# Altium project BLDC.PRJPCB
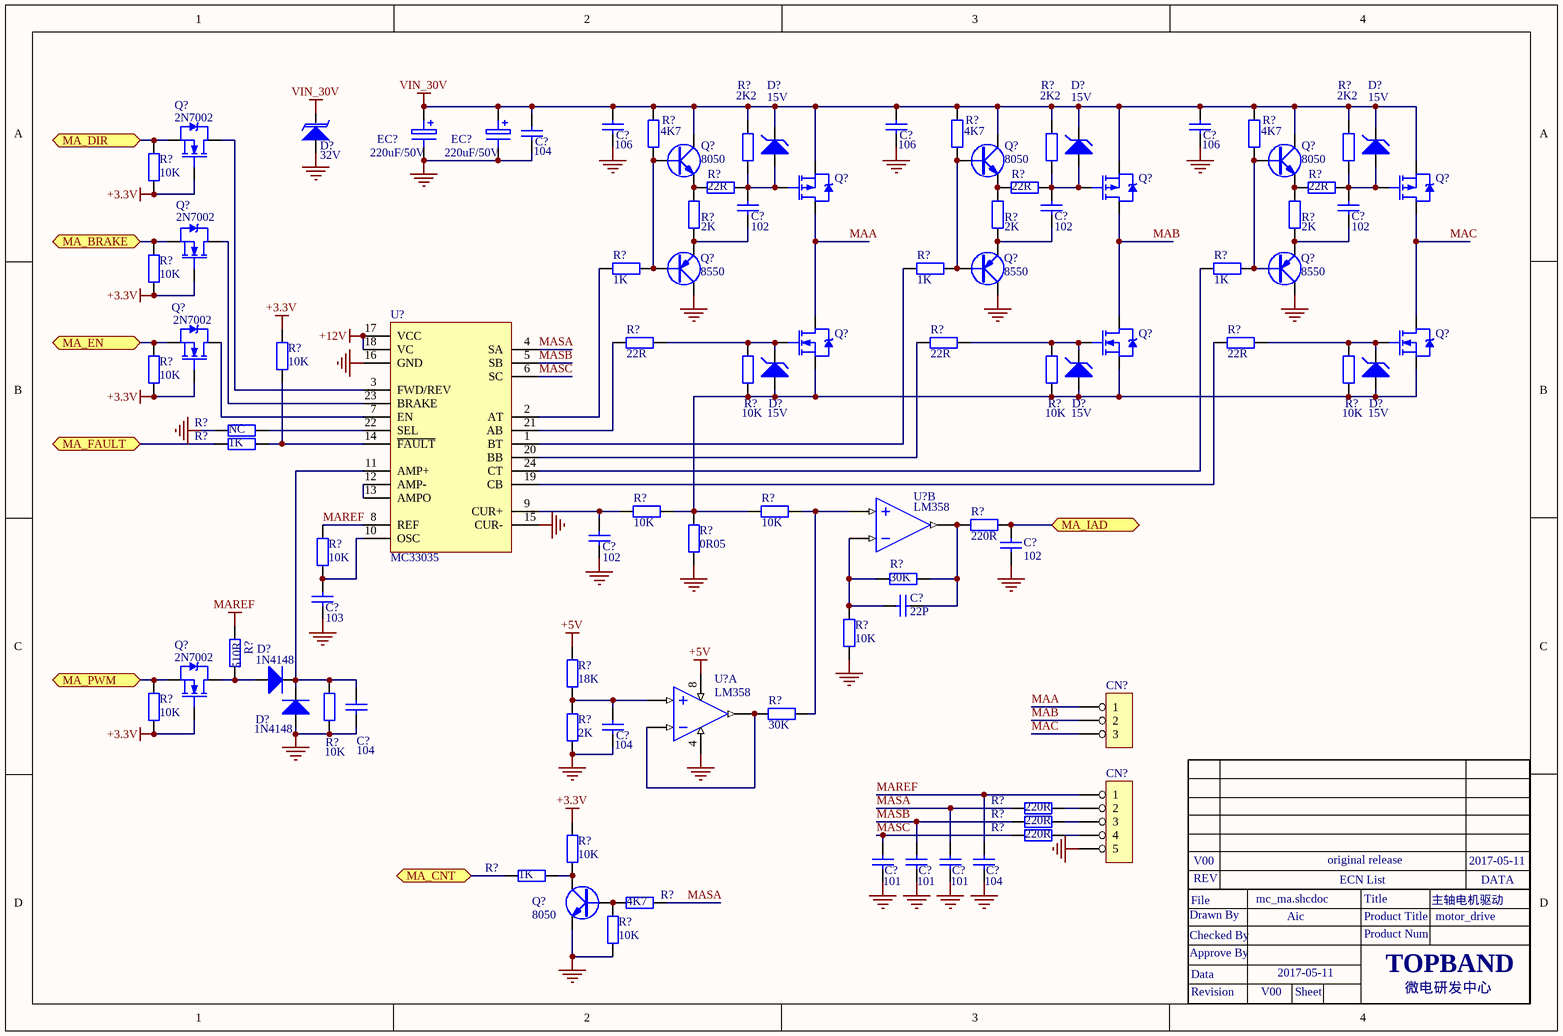
[diagram p0: mc_bldc.SchDoc]
2 sheets, 132 parts. Net scope: flat (ports and power ports of the same name join across sheets).
Sheets:
  mc_bldc.SchDoc
  mc_ds.SchDoc

## Sheet mc_bldc.SchDoc
size A4

### Parts
(Parts that share a designator on the sheet are numbered #1, #2 ... from top to bottom, then left to right.)
C?#1  106  [0603C]
C?#2  106  [0603C]
C?#3  106  [0603C]
C?#4  104  [0603C]
C?#5  102  [0805C]
C?#6  102  [0805C]
C?#7  102  [0805C]
C?#8  102  [0805C]
C?#9  102  [0603C]
C?#10  103  [0805C]
C?#11  22P  [0603C]
C?#12  104  [0805C]
C?#13  104  [0603C]
C?#14  101  [0603C]
C?#15  101  [0603C]
C?#16  101  [0603C]
C?#17  104  [0603C]
CN?#1  (no value)  [con3-2.54pa]
CN?#2  (no value)  [CON5-2.54卧式]
D?#1  32V  [SOD-123]
D?#2  15V  [SOD-123]
D?#3  15V  [SOD-123]
D?#4  15V  [SOD-123]
D?#5  15V  [SOD-123]
D?#6  15V  [SOD-123]
D?#7  15V  [SOD-123]
D?#8  1N4148  [SOD-123]
D?#9  1N4148  [SOD-123]
EC?#1  220uF/50V  [EC8]
EC?#2  220uF/50V  [EC8]
Q?#1  8050  [SOT-23-BCE]
Q?#2  8050  [SOT-23-BCE]
Q?#3  8050  [SOT-23-BCE]
Q?#4  2N7002  [D2PAK]
Q?#5  (no value)  [D2PAK]
Q?#6  (no value)  [D2PAK]
Q?#7  (no value)  [D2PAK]
Q?#8  8550  [SOT-23-BCE]
Q?#9  8550  [SOT-23-BCE]
Q?#10  8550  [SOT-23-BCE]
Q?#11  2N7002  [D2PAK]
Q?#12  (no value)  [D2PAK]
Q?#13  (no value)  [D2PAK]
Q?#14  (no value)  [D2PAK]
Q?#15  2N7002  [D2PAK]
Q?#16  2N7002  [D2PAK]
Q?#17  8050  [SOT-23-BCE]
R?#1  4K7  [0603R]
R?#2  4K7  [0603R]
R?#3  4K7  [0603R]
R?#4  2K2  [0805R]
R?#5  2K2  [0805R]
R?#6  2K2  [0805R]
R?#7  22R  [0805R]
R?#8  22R  [0805R]
R?#9  22R  [0805R]
R?#10  10K  [0603R]
R?#11  2K  [0805R]
R?#12  2K  [0805R]
R?#13  2K  [0805R]
R?#14  1K  [0603R]
R?#15  1K  [0603R]
R?#16  1K  [0603R]
R?#17  10K  [0603R]
R?#18  22R  [0805R]
R?#19  22R  [0805R]
R?#20  22R  [0805R]
R?#21  10K  [0603R]
R?#22  10K  [0603R]
R?#23  10K  [0603]
R?#24  10K  [0603]
R?#25  10K  [0603]
R?#26  NC  [0603R]
R?#27  1K  [0603R]
R?#28  10K  [0603R]
R?#29  10K  [0603R]
R?#30  220R  [0603R]
R?#31  0R05  [2512R]
R?#32  10K  [0603R]
R?#33  30K  [0603R]
R?#34  10K  [0603R]
R?#35  510R  [0603R]
R?#36  18K  [0603R]
R?#37  30K  [0603R]
R?#38  10K  [0603R]
R?#39  10K  [0603R]
R?#40  2K  [0603R]
R?#41  220R  [0603R]
R?#42  220R  [0603R]
R?#43  220R  [0603R]
R?#44  1K  [0603R]
R?#45  10K  [0603R]
R?#46  4K7  [0603R]
R?#47  10K  [0603R]
U?#1  MC33035  [SOP-24]
U?#2  LM358  [SO-8]  (part B of 2)
U?#3  LM358  [SO-8]  (part A of 2)

### Ports
MA_BRAKE, MA_CNT, MA_DIR, MA_EN, MA_FAULT, MA_IAD, MA_PWM

### Nets
+3.3V: Q?#4.G Q?#11.G Q?#15.G Q?#16.G R?#10.1 R?#17.1 R?#21.2 R?#22.1 R?#38.1 R?#45.2
+5V: R?#36.2 U?#3.8(VCC)
+12V: U?#1.17(VCC) U?#1.18(VC)
GND: C?#1.1 C?#2.1 C?#3.1 C?#4.1 C?#8.2 C?#9.2 C?#10.2 C?#12.2 C?#13.1 C?#14.2 C?#15.2 C?#16.2 C?#17.2 CN?#2.5 D?#1.A D?#9.A EC?#1.2 EC?#2.2 Q?#8.C Q?#9.C Q?#10.C Q?#17.E R?#26.1 R?#31.1 R?#34.1 R?#39.1 R?#40.1 R?#47.1 U?#1.15(CUR-) U?#1.16(GND) U?#3.4(GND)
MAREF: C?#17.1 CN?#2.1 R?#32.2 R?#35.2 U?#1.8(REF)
VIN_30V: C?#1.2 C?#2.2 C?#3.2 C?#4.2 D?#1.K D?#2.K D?#3.K D?#4.K EC?#1.1 EC?#2.1 Q?#1.C Q?#2.C Q?#3.C Q?#5.S Q?#6.S Q?#7.S R?#1.1 R?#2.1 R?#3.1 R?#4.1 R?#5.1 R?#6.1
MAA: CN?#1.1 Q?#5.D Q?#12.D
MAB: CN?#1.2 Q?#6.D Q?#13.D
MAC: CN?#1.3 Q?#7.D Q?#14.D
MASA: C?#16.1 R?#41.1 R?#46.2 U?#1.4(SA)
MASB: C?#15.1 R?#42.1 U?#1.5(SB)
MASC: C?#14.1 R?#43.1 U?#1.6(SC)
NetC?#5_1: C?#5.1 D?#2.A Q?#5.G R?#4.2 R?#7.2
NetC?#5_2: C?#5.2 Q?#8.E R?#11.2
NetC?#6_1: C?#6.1 D?#3.A Q?#6.G R?#5.2 R?#8.2
NetC?#6_2: C?#6.2 Q?#9.E R?#12.2
NetC?#7_1: C?#7.1 D?#4.A Q?#7.G R?#6.2 R?#9.2
NetC?#7_2: C?#7.2 Q?#10.E R?#13.2
NetC?#8_1: C?#8.1 R?#28.1 U?#1.9(CUR+)
NetC?#9_1: C?#9.1 R?#30.2 ; port MA_IAD
NetC?#10_1: C?#10.1 R?#32.1 U?#1.10(OSC)
NetC?#11_1: C?#11.1 R?#30.1 R?#33.1 U?#2.1(OUT2)
NetC?#11_2: C?#11.2 R?#33.2 R?#34.2 U?#2.2(-IN2)
NetC?#12_1: C?#12.1 D?#8.K D?#9.K R?#39.2 U?#1.11(AMP+)
NetC?#13_2: C?#13.2 R?#36.1 R?#40.2 U?#3.5(+IN1)
NetCN?#2_2: CN?#2.2 R?#41.2
NetCN?#2_3: CN?#2.3 R?#42.2
NetCN?#2_4: CN?#2.4 R?#43.2
NetD?#5_A: D?#5.A D?#6.A D?#7.A Q?#12.S Q?#13.S Q?#14.S R?#23.1 R?#24.1 R?#25.1 R?#28.2 R?#29.1 R?#31.2
NetD?#5_K: D?#5.K Q?#12.G R?#18.2 R?#23.2
NetD?#6_K: D?#6.K Q?#13.G R?#19.2 R?#24.2
NetD?#7_K: D?#7.K Q?#14.G R?#20.2 R?#25.2
NetD?#8_A: D?#8.A Q?#16.D R?#35.1
NetQ?#1_B: Q?#1.B Q?#8.B R?#1.2 R?#14.2
NetQ?#1_E: Q?#1.E R?#7.1 R?#11.1
NetQ?#2_B: Q?#2.B Q?#9.B R?#2.2 R?#15.2
NetQ?#2_E: Q?#2.E R?#8.1 R?#12.1
NetQ?#3_B: Q?#3.B Q?#10.B R?#3.2 R?#16.2
NetQ?#3_E: Q?#3.E R?#9.1 R?#13.1
NetQ?#4_D: Q?#4.D U?#1.3(FWD/REV)
NetQ?#4_S: Q?#4.S R?#10.2 ; port MA_DIR
NetQ?#11_D: Q?#11.D U?#1.23(BRAKE)
NetQ?#11_S: Q?#11.S R?#17.2 ; port MA_BRAKE
NetQ?#15_D: Q?#15.D U?#1.7(EN)
NetQ?#15_S: Q?#15.S R?#22.2 ; port MA_EN
NetQ?#16_S: Q?#16.S R?#38.2 ; port MA_PWM
NetQ?#17_B: Q?#17.B R?#46.1 R?#47.2
NetQ?#17_C: Q?#17.C R?#44.2 R?#45.1
NetR?#14_1: R?#14.1 U?#1.2(AT)
NetR?#15_1: R?#15.1 U?#1.1(BT)
NetR?#16_1: R?#16.1 U?#1.24(CT)
NetR?#18_1: R?#18.1 U?#1.21(AB)
NetR?#19_1: R?#19.1 U?#1.20(BB)
NetR?#20_1: R?#20.1 U?#1.19(CB)
NetR?#21_1: R?#21.1 R?#27.2 U?#1.14(~{FAULT})
NetR?#26_2: R?#26.2 U?#1.22(SEL)
NetR?#27_1: R?#27.1 ; port MA_FAULT
NetR?#29_2: R?#29.2 R?#37.2 U?#2.3(IN2+)
NetR?#37_1: R?#37.1 U?#3.6(-IN1) U?#3.7(OUT1)
NetR?#44_1: R?#44.1 ; port MA_CNT
NetU?#1_12: U?#1.12(AMP-) U?#1.13(AMPO)

### Notes on the sheet
- Drawn By
- File
- REV
- V00
- mc_ma.shcdoc
- Aic
- original release
- ECN List
- Product Title
- Title
- 主轴电机驱动
- motor_drive
- 2017-05-11
- DATA
- Approve By
- Checked By
- Data
- Product Num
- TOPBAND
- Revision
- Sheet
- 微电研发中心

### Library data of the parts
C?#1-C?#17 = Cap(0603): Component Kind: standard; Component Type: standard
CN?#1 = 3P: 排线; U_TABLE: U_SAM01021604; id: 21; Part Number: 3P; Component Kind: standard; Component Type: standard; Designator: 3P; Pin Count: 3
CN?#2 = 5Pin(卧式): 插座; U_TABLE: U_SAM01021601; id: 32; Part Number: 5Pin(卧式); Component Kind: standard; Component Type: standard; Designator: 5Pin(卧式); Pin Count: 5
D?#1 = Diode(TVS_贴片)_1: TVS管; U_TABLE: U_SAM010203; id: 28; Part Number: Diode(TVS_贴片)_1; Component Kind: standard; Component Type: standard; Pin Count: 2
D?#2-D?#7 = D Zener(贴片): 120301465; U_TABLE: U_SAM010203; id: 25; Description: 稳压二极管; Part Number: D Zener(贴片); Component Kind: standard; Component Type: standard; Pin Count: 2
D?#8 D?#9 = Diode(贴片)_1: 二极管; U_TABLE: U_SAM010203; id: 27; Part Number: Diode(贴片)_1; Component Kind: standard; Component Type: standard; Pin Count: 2
EC?#1 EC?#2 = Electro(2.5mm): 电解电容; U_TABLE: U_SAM010202; id: 42; Part Number: Electro(2.5mm); Component Kind: standard; Component Type: standard; Pin Count: 2
Q?#1-Q?#3 Q?#17 = NPN(贴片): 三极管; U_TABLE: U_SAM010204; id: 18; Part Number: NPN(贴片); Component Kind: standard; Component Type: standard; Pin Count: 3
Q?#4 Q?#11-Q?#16 = NMOS-2: MOS管; U_TABLE: U_SAM010204; id: 17; Part Number: NMOS-2; Component Kind: standard; Component Type: standard; Pin Count: 3
Q?#5-Q?#7 = PMOS-2: MOS管; U_TABLE: U_SAM010204; id: 19; Part Number: PMOS-2; Component Kind: standard; Component Type: standard; Pin Count: 3
Q?#8-Q?#10 = PNP(贴片): 三极管; U_TABLE: U_SAM010204; id: 20; Part Number: PNP(贴片); Component Kind: standard; Component Type: standard; Pin Count: 3
R?#1-R?#13 R?#17-R?#26 R?#28 R?#31 R?#32 R?#35 R?#38 R?#39 R?#41-R?#43 R?#45-R?#47 = Res2: Resistor; Value: 1K; 物料编码: 150103083; Published: 8-Jun-2000; LatestRevisionDate: 17-Jul-2002; LatestRevisionNote: Re-released for DXP Platform.; PackageReference: AXIAL-0.4; Publisher: Altium Limited
R?#14-R?#16 R?#27 R?#44 = Res2: Resistor; 物料编码: 150103083; Published: 8-Jun-2000; LatestRevisionDate: 17-Jul-2002; LatestRevisionNote: Re-released for DXP Platform.; PackageReference: AXIAL-0.4; Publisher: Altium Limited; Value: 1K
R?#29 R?#30 R?#33 R?#34 R?#37 = Res2: Resistor; Value: 1K; Published: 8-Jun-2000; LatestRevisionDate: 17-Jul-2002; LatestRevisionNote: Re-released for DXP Platform.; PackageReference: AXIAL-0.4; Publisher: Altium Limited
R?#36 R?#40 = Res2: Resistor; Published: 8-Jun-2000; LatestRevisionDate: 17-Jul-2002; LatestRevisionNote: Re-released for DXP Platform.; PackageReference: AXIAL-0.4; Publisher: Altium Limited
U?#2 U?#3 = IC_LM358: 121000225; U_TABLE: U_SAM010210; Description: 集成电路; id: 83; U_ITEM_ID（物料编码）: 121000100; U_100114（SAP物料描述）: SMT运放LM358_SO-8_TI_环保; U_100047（环保属性）: 环保; U_100107（工厂BOM使用频率）: 1000:1;1500:12;3000:7;5000:14;; U_100105（工厂库存）: 1000:7508.000;1500:160.000;2000:0.000;3000:485.000;5000:1542.000;; U_100117（工厂采购量）: 1000:7500.000;1500:300.000;3000:2500.000;5000:7500.000;; Part Number: IC_LM358; Component Kind: standard; Component Type: standard; Designator: IC_LM358; Footprint: DIP14; Pin Count: 8; U_100076（型号）: LM358; U_100040（封装方式）: SO-8; U_100086（指定供应商）: TI

## Sheet mc_ds.SchDoc
size A4
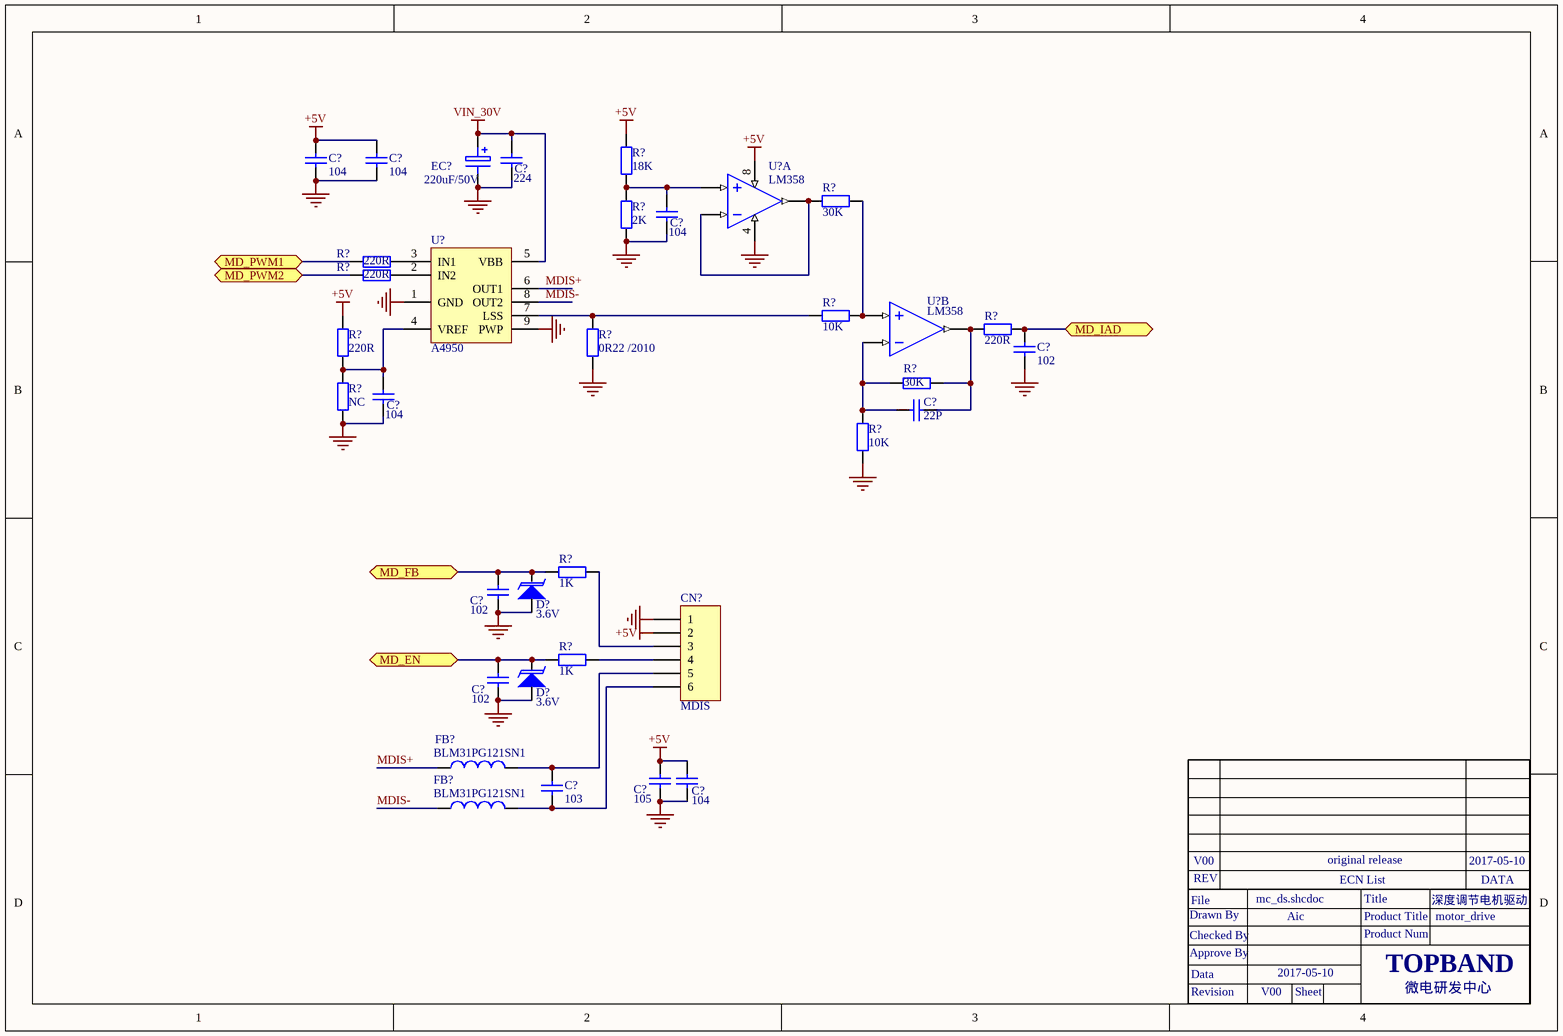
[diagram p1: mc_ds.SchDoc]

### Parts
(Parts that share a designator on the sheet are numbered #1, #2 ... from top to bottom, then left to right.)
C?#18  104  [0603C]
C?#19  104  [0603C]
C?#20  224  [0603C]
C?#21  104  [0603C]
C?#22  102  [0603C]
C?#23  22P  [0603C]
C?#24  104  [0603C]
C?#25  102  [0805C]
C?#26  102  [0805C]
C?#27  105  [0805C]
C?#28  104  [0603C]
C?#29  103  [0805C]
CN?#3  MDIS  [HDR1X6]
D?#10  3.6V  [SOD-123]
D?#11  3.6V  [SOD-123]
EC?#3  220uF/50V  [EC8]
FB?#1  BLM31PG121SN1  [1206R]
FB?#2  BLM31PG121SN1  [1206R]
R?#48  18K  [0603R]
R?#49  30K  [0603R]
R?#50  2K  [0603R]
R?#51  220R  [0603R]
R?#52  220R  [0603R]
R?#53  10K  [0603R]
R?#54  220R  [0603R]
R?#55  220R  [0603R]
R?#56  0R22 /2010  [2010R]
R?#57  30K  [0603R]
R?#58  NC  [0603R]
R?#59  10K  [0603R]
R?#60  1K  [0603R]
R?#61  1K  [0603R]
U?#4  LM358  [SO-8]  (part A of 2)
U?#5  A4950  [SO-8 - E]
U?#6  LM358  [SO-8]  (part B of 2)

### Ports
MD_EN, MD_FB, MD_IAD, MD_PWM1, MD_PWM2

### Nets
+5V: C?#18.2 C?#19.2 C?#27.1 C?#28.1 CN?#3.2 R?#48.2 R?#55.1 U?#4.8(VCC)
GND: C?#18.1 C?#19.1 C?#20.1 C?#21.1 C?#22.2 C?#24.1 C?#25.2 C?#26.2 C?#27.2 C?#28.2 CN?#3.1 D?#10.A D?#11.A EC?#3.2 R?#50.1 R?#56.2 R?#58.1 R?#59.1 U?#4.4(GND) U?#5.1(GND) U?#5.9(PWP)
VIN_30V: C?#20.2 EC?#3.1 U?#5.5(VBB)
MDIS+: FB?#1.1 U?#5.6(OUT1)
MDIS-: FB?#2.1 U?#5.8(OUT2)
NetC?#21_2: C?#21.2 R?#48.1 R?#50.2 U?#4.5(+IN1)
NetC?#22_1: C?#22.1 R?#54.2 ; port MD_IAD
NetC?#23_1: C?#23.1 R?#54.1 R?#57.1 U?#6.1(OUT2)
NetC?#23_2: C?#23.2 R?#57.2 R?#59.2 U?#6.2(-IN2)
NetC?#24_2: C?#24.2 R?#55.2 R?#58.2 U?#5.4(VREF)
NetC?#25_1: C?#25.1 D?#10.K R?#60.2 ; port MD_FB
NetC?#26_1: C?#26.1 D?#11.K R?#61.2 ; port MD_EN
NetC?#29_1: C?#29.1 CN?#3.5 FB?#1.2
NetC?#29_2: C?#29.2 CN?#3.6 FB?#2.2
NetCN?#3_3: CN?#3.3 R?#60.1
NetCN?#3_4: CN?#3.4 R?#61.1
NetR?#49_1: R?#49.1 U?#4.6(-IN1) U?#4.7(OUT1)
NetR?#49_2: R?#49.2 R?#53.2 U?#6.3(IN2+)
NetR?#51_1: R?#51.1 ; port MD_PWM1
NetR?#51_2: R?#51.2 U?#5.3(IN1)
NetR?#52_1: R?#52.1 ; port MD_PWM2
NetR?#52_2: R?#52.2 U?#5.2(IN2)
NetR?#53_1: R?#53.1 R?#56.1 U?#5.7(LSS)

### Notes on the sheet
- Drawn By
- File
- REV
- V00
- mc_ds.shcdoc
- Aic
- original release
- ECN List
- Product Title
- Title
- 深度调节电机驱动
- motor_drive
- 2017-05-10
- DATA
- Approve By
- Checked By
- Data
- Product Num
- TOPBAND
- Revision
- Sheet
- 微电研发中心

### Library data of the parts
C?#18-C?#29 = Cap(0603): Component Kind: standard; Component Type: standard
CN?#3 = Header 6: Header, 6-Pin; LatestRevisionDate: 17-Jul-2002; LatestRevisionNote: Re-released for DXP Platform.; Publisher: Altium Limited
D?#10 D?#11 = Diode(TVS_贴片)_1: TVS管; U_TABLE: U_SAM010203; id: 28; Part Number: Diode(TVS_贴片)_1; Component Kind: standard; Component Type: standard; Pin Count: 2
EC?#3 = Electro(2.5mm): 电解电容; U_TABLE: U_SAM010202; id: 42; Part Number: Electro(2.5mm); Component Kind: standard; Component Type: standard; Pin Count: 2
FB?#1 FB?#2 = Inductor: 电感; U_TABLE: U_SAM010207; id: 53; Part Number: Inductor; Component Kind: Standard; Component Type: Standard; Pin Count: 2
R?#48 R?#50 R?#60 R?#61 = Res2: Resistor; Published: 8-Jun-2000; LatestRevisionDate: 17-Jul-2002; LatestRevisionNote: Re-released for DXP Platform.; PackageReference: AXIAL-0.4; Publisher: Altium Limited
  R?#60 R?#61: Value: 1K
R?#49 R?#51-R?#55 R?#57-R?#59 = Res2: Resistor; Value: 1K; Published: 8-Jun-2000; LatestRevisionDate: 17-Jul-2002; LatestRevisionNote: Re-released for DXP Platform.; PackageReference: AXIAL-0.4; Publisher: Altium Limited
R?#56 = Res2: Resistor; Value: 1K; 物料编码: 150103083; Published: 8-Jun-2000; LatestRevisionDate: 17-Jul-2002; LatestRevisionNote: Re-released for DXP Platform.; PackageReference: AXIAL-0.4; Publisher: Altium Limited
U?#4 U?#6 = IC_LM358: as U?#2 on sheet mc_bldc; Part Number: IC_LM358; Component Kind: standard; Component Type: standard; Designator: IC_LM358; Footprint: DIP14; Pin Count: 8; U_100076（型号）: LM358; U_100040（封装方式）: SO-8; U_100086（指定供应商）: TI

## Nets that join several sheets
+5V: mc_bldc (R?#36.2 U?#3.8), mc_ds (8 pins)
GND: mc_bldc (31 pins), mc_ds (21 pins)
VIN_30V: mc_bldc (22 pins), mc_ds (C?#20.2 EC?#3.1 U?#5.5)